# EAGLE design diodes (EAGLE 6.6.0)
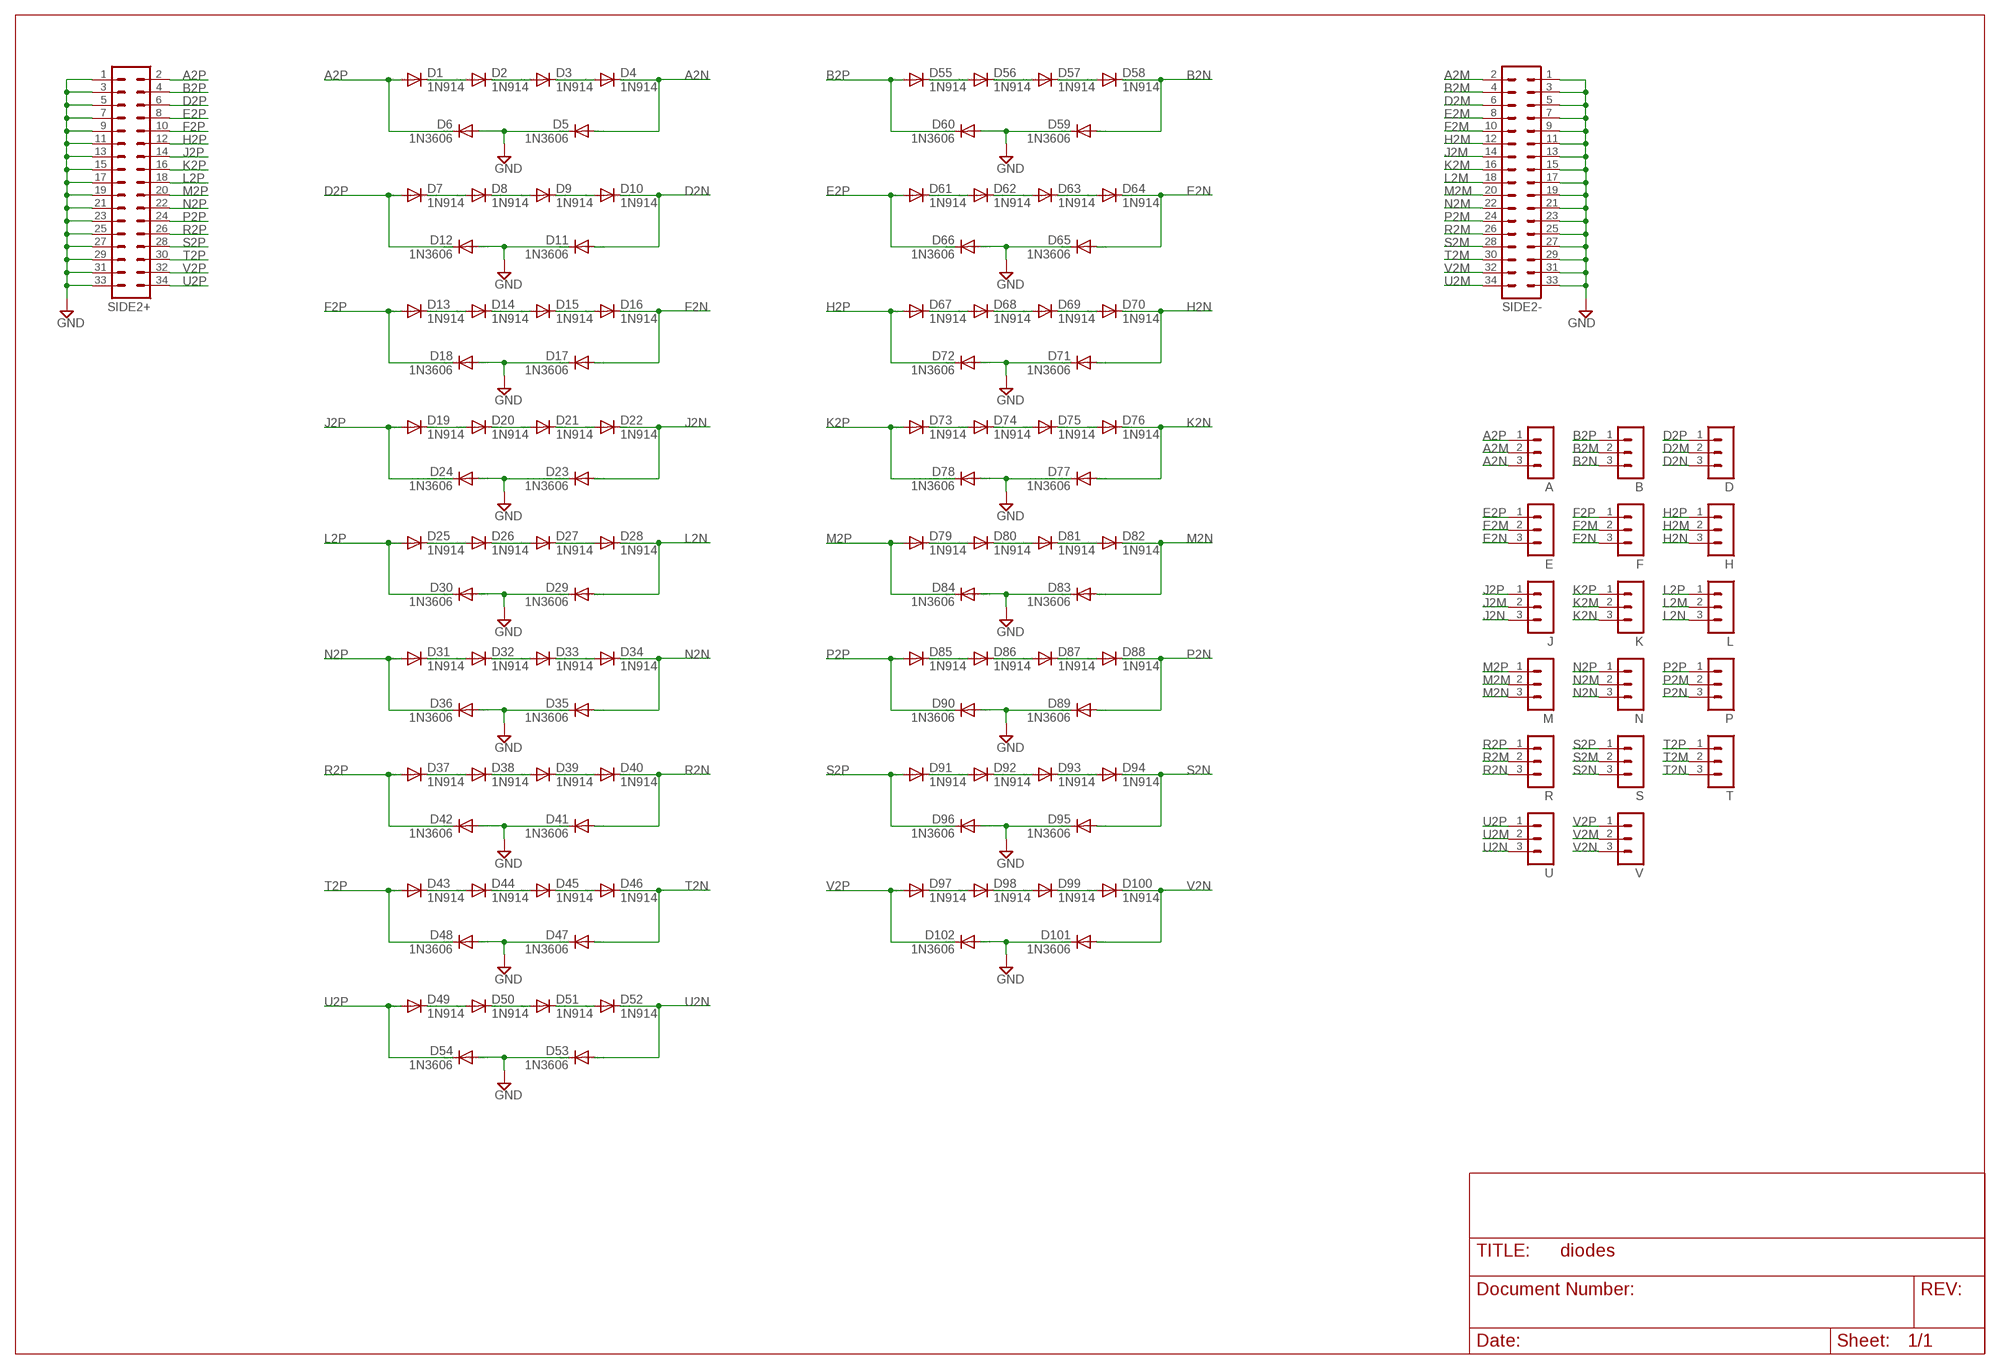
[diagram p0: schematic, sheet 1]

## Parts
A  MA03-1  [MA03-1]
B  MA03-1  [MA03-1]
D  MA03-1  [MA03-1]
D1  1N914  DIODE-DO35-10  [DO35-10]
D2  1N914  DIODE-DO35-10  [DO35-10]
D3  1N914  DIODE-DO35-10  [DO35-10]
D4  1N914  DIODE-DO35-10  [DO35-10]
D5  1N3606  DIODE-DO35-10  [DO35-10]
D6  1N3606  DIODE-DO35-10  [DO35-10]
D7  1N914  DIODE-DO35-10  [DO35-10]
D8  1N914  DIODE-DO35-10  [DO35-10]
D9  1N914  DIODE-DO35-10  [DO35-10]
D10  1N914  DIODE-DO35-10  [DO35-10]
D11  1N3606  DIODE-DO35-10  [DO35-10]
D12  1N3606  DIODE-DO35-10  [DO35-10]
D13  1N914  DIODE-DO35-10  [DO35-10]
D14  1N914  DIODE-DO35-10  [DO35-10]
D15  1N914  DIODE-DO35-10  [DO35-10]
D16  1N914  DIODE-DO35-10  [DO35-10]
D17  1N3606  DIODE-DO35-10  [DO35-10]
D18  1N3606  DIODE-DO35-10  [DO35-10]
D19  1N914  DIODE-DO35-10  [DO35-10]
D20  1N914  DIODE-DO35-10  [DO35-10]
D21  1N914  DIODE-DO35-10  [DO35-10]
D22  1N914  DIODE-DO35-10  [DO35-10]
D23  1N3606  DIODE-DO35-10  [DO35-10]
D24  1N3606  DIODE-DO35-10  [DO35-10]
D25  1N914  DIODE-DO35-10  [DO35-10]
D26  1N914  DIODE-DO35-10  [DO35-10]
D27  1N914  DIODE-DO35-10  [DO35-10]
D28  1N914  DIODE-DO35-10  [DO35-10]
D29  1N3606  DIODE-DO35-10  [DO35-10]
D30  1N3606  DIODE-DO35-10  [DO35-10]
D31  1N914  DIODE-DO35-10  [DO35-10]
D32  1N914  DIODE-DO35-10  [DO35-10]
D33  1N914  DIODE-DO35-10  [DO35-10]
D34  1N914  DIODE-DO35-10  [DO35-10]
D35  1N3606  DIODE-DO35-10  [DO35-10]
D36  1N3606  DIODE-DO35-10  [DO35-10]
D37  1N914  DIODE-DO35-10  [DO35-10]
D38  1N914  DIODE-DO35-10  [DO35-10]
D39  1N914  DIODE-DO35-10  [DO35-10]
D40  1N914  DIODE-DO35-10  [DO35-10]
D41  1N3606  DIODE-DO35-10  [DO35-10]
D42  1N3606  DIODE-DO35-10  [DO35-10]
D43  1N914  DIODE-DO35-10  [DO35-10]
D44  1N914  DIODE-DO35-10  [DO35-10]
D45  1N914  DIODE-DO35-10  [DO35-10]
D46  1N914  DIODE-DO35-10  [DO35-10]
D47  1N3606  DIODE-DO35-10  [DO35-10]
D48  1N3606  DIODE-DO35-10  [DO35-10]
D49  1N914  DIODE-DO35-10  [DO35-10]
D50  1N914  DIODE-DO35-10  [DO35-10]
D51  1N914  DIODE-DO35-10  [DO35-10]
D52  1N914  DIODE-DO35-10  [DO35-10]
D53  1N3606  DIODE-DO35-10  [DO35-10]
D54  1N3606  DIODE-DO35-10  [DO35-10]
D55  1N914  DIODE-DO35-10  [DO35-10]
D56  1N914  DIODE-DO35-10  [DO35-10]
D57  1N914  DIODE-DO35-10  [DO35-10]
D58  1N914  DIODE-DO35-10  [DO35-10]
D59  1N3606  DIODE-DO35-10  [DO35-10]
D60  1N3606  DIODE-DO35-10  [DO35-10]
D61  1N914  DIODE-DO35-10  [DO35-10]
D62  1N914  DIODE-DO35-10  [DO35-10]
D63  1N914  DIODE-DO35-10  [DO35-10]
D64  1N914  DIODE-DO35-10  [DO35-10]
D65  1N3606  DIODE-DO35-10  [DO35-10]
D66  1N3606  DIODE-DO35-10  [DO35-10]
D67  1N914  DIODE-DO35-10  [DO35-10]
D68  1N914  DIODE-DO35-10  [DO35-10]
D69  1N914  DIODE-DO35-10  [DO35-10]
D70  1N914  DIODE-DO35-10  [DO35-10]
D71  1N3606  DIODE-DO35-10  [DO35-10]
D72  1N3606  DIODE-DO35-10  [DO35-10]
D73  1N914  DIODE-DO35-10  [DO35-10]
D74  1N914  DIODE-DO35-10  [DO35-10]
D75  1N914  DIODE-DO35-10  [DO35-10]
D76  1N914  DIODE-DO35-10  [DO35-10]
D77  1N3606  DIODE-DO35-10  [DO35-10]
D78  1N3606  DIODE-DO35-10  [DO35-10]
D79  1N914  DIODE-DO35-10  [DO35-10]
D80  1N914  DIODE-DO35-10  [DO35-10]
D81  1N914  DIODE-DO35-10  [DO35-10]
D82  1N914  DIODE-DO35-10  [DO35-10]
D83  1N3606  DIODE-DO35-10  [DO35-10]
D84  1N3606  DIODE-DO35-10  [DO35-10]
D85  1N914  DIODE-DO35-10  [DO35-10]
D86  1N914  DIODE-DO35-10  [DO35-10]
D87  1N914  DIODE-DO35-10  [DO35-10]
D88  1N914  DIODE-DO35-10  [DO35-10]
D89  1N3606  DIODE-DO35-10  [DO35-10]
D90  1N3606  DIODE-DO35-10  [DO35-10]
D91  1N914  DIODE-DO35-10  [DO35-10]
D92  1N914  DIODE-DO35-10  [DO35-10]
D93  1N914  DIODE-DO35-10  [DO35-10]
D94  1N914  DIODE-DO35-10  [DO35-10]
D95  1N3606  DIODE-DO35-10  [DO35-10]
D96  1N3606  DIODE-DO35-10  [DO35-10]
D97  1N914  DIODE-DO35-10  [DO35-10]
D98  1N914  DIODE-DO35-10  [DO35-10]
D99  1N914  DIODE-DO35-10  [DO35-10]
D100  1N914  DIODE-DO35-10  [DO35-10]
D101  1N3606  DIODE-DO35-10  [DO35-10]
D102  1N3606  DIODE-DO35-10  [DO35-10]
E  MA03-1  [MA03-1]
F  MA03-1  [MA03-1]
H  MA03-1  [MA03-1]
J  MA03-1  [MA03-1]
K  MA03-1  [MA03-1]
L  MA03-1  [MA03-1]
M  MA03-1  [MA03-1]
N  MA03-1  [MA03-1]
P  MA03-1  [MA03-1]
R  MA03-1  [MA03-1]
S  MA03-1  [MA03-1]
SIDE2+  MA17-2  [MA17-2]
SIDE2-  MA17-2  [MA17-2]
T  MA03-1  [MA03-1]
U  MA03-1  [MA03-1]
V  MA03-1  [MA03-1]

## Nets
A2M: A.2 SIDE2-.2
A2N: A.3 D4.C D5.A
A2P: A.1 D1.A D6.C SIDE2+.2
B2M: B.2 SIDE2-.4
B2N: B.3 D58.C D59.A
B2P: B.1 D55.A D60.C SIDE2+.4
D2M: D.2 SIDE2-.6
D2N: D10.C D11.A D.3
D2P: D7.A D12.C D.1 SIDE2+.6
E2M: E.2 SIDE2-.8
E2N: D64.C D65.A E.3
E2P: D61.A D66.C E.1 SIDE2+.8
F2M: F.2 SIDE2-.10
F2N: D16.C D17.A F.3
F2P: D13.A D18.C F.1 SIDE2+.10
GND [Supply]: D5.C D6.A D11.C D12.A D17.C D18.A D23.C D24.A D29.C D30.A D35.C D36.A D41.C D42.A D47.C D48.A D53.C D54.A D59.C D60.A D65.C D66.A D71.C D72.A D77.C D78.A D83.C D84.A D89.C D90.A D95.C D96.A D101.C D102.A SIDE2+.1 SIDE2+.3 SIDE2+.5 SIDE2+.7 SIDE2+.9 SIDE2+.11 SIDE2+.13 SIDE2+.15 SIDE2+.17 SIDE2+.19 SIDE2+.21 SIDE2+.23 SIDE2+.25 SIDE2+.27 SIDE2+.29 SIDE2+.31 SIDE2+.33 SIDE2-.1 SIDE2-.3 SIDE2-.5 SIDE2-.7 SIDE2-.9 SIDE2-.11 SIDE2-.13 SIDE2-.15 SIDE2-.17 SIDE2-.19 SIDE2-.21 SIDE2-.23 SIDE2-.25 SIDE2-.27 SIDE2-.29 SIDE2-.31 SIDE2-.33
H2M: H.2 SIDE2-.12
H2N: D70.C D71.A H.3
H2P: D67.A D72.C H.1 SIDE2+.12
J2M: J.2 SIDE2-.14
J2N: D22.C D23.A J.3
J2P: D19.A D24.C J.1 SIDE2+.14
K2M: K.2 SIDE2-.16
K2N: D76.C D77.A K.3
K2P: D73.A D78.C K.1 SIDE2+.16
L2M: L.2 SIDE2-.18
L2N: D28.C D29.A L.3
L2P: D25.A D30.C L.1 SIDE2+.18
M2M: M.2 SIDE2-.20
M2N: D82.C D83.A M.3
M2P: D79.A D84.C M.1 SIDE2+.20
N2M: N.2 SIDE2-.22
N2N: D34.C D35.A N.3
N2P: D31.A D36.C N.1 SIDE2+.22
N$1: D1.C D2.A
N$2: D2.C D3.A
N$3: D3.C D4.A
N$4: D7.C D8.A
N$5: D8.C D9.A
N$6: D9.C D10.A
N$7: D13.C D14.A
N$8: D14.C D15.A
N$9: D15.C D16.A
N$10: D19.C D20.A
N$11: D20.C D21.A
N$12: D21.C D22.A
N$13: D25.C D26.A
N$14: D26.C D27.A
N$15: D27.C D28.A
N$16: D31.C D32.A
N$17: D32.C D33.A
N$18: D33.C D34.A
N$19: D37.C D38.A
N$20: D38.C D39.A
N$21: D39.C D40.A
N$22: D43.C D44.A
N$23: D44.C D45.A
N$24: D45.C D46.A
N$25: D49.C D50.A
N$26: D50.C D51.A
N$27: D51.C D52.A
N$28: D55.C D56.A
N$29: D56.C D57.A
N$30: D57.C D58.A
N$31: D61.C D62.A
N$32: D62.C D63.A
N$33: D63.C D64.A
N$34: D67.C D68.A
N$35: D68.C D69.A
N$36: D69.C D70.A
N$37: D73.C D74.A
N$38: D74.C D75.A
N$39: D75.C D76.A
N$40: D79.C D80.A
N$41: D80.C D81.A
N$42: D81.C D82.A
N$43: D85.C D86.A
N$44: D86.C D87.A
N$45: D87.C D88.A
N$46: D91.C D92.A
N$47: D92.C D93.A
N$48: D93.C D94.A
N$49: D97.C D98.A
N$50: D98.C D99.A
N$51: D99.C D100.A
P2M: P.2 SIDE2-.24
P2N: D88.C D89.A P.3
P2P: D85.A D90.C P.1 SIDE2+.24
R2M: R.2 SIDE2-.26
R2N: D40.C D41.A R.3
R2P: D37.A D42.C R.1 SIDE2+.26
S2M: S.2 SIDE2-.28
S2N: D94.C D95.A S.3
S2P: D91.A D96.C S.1 SIDE2+.28
T2M: SIDE2-.30 T.2
T2N: D46.C D47.A T.3
T2P: D43.A D48.C SIDE2+.30 T.1
U2M: SIDE2-.34 U.2
U2N: D52.C D53.A U.3
U2P: D49.A D54.C SIDE2+.34 U.1
V2M: SIDE2-.32 V.2
V2N: D100.C D101.A V.3
V2P: D97.A D102.C SIDE2+.32 V.1

## Library data of the parts
A B D E F H J K L M N P R S T U V = con-lstb:MA03-1: PIN HEADER; OC_FARNELL: unknown; OC_NEWARK: unknown
D1-D102 = diode:DIODE-: DIODE
SIDE2+ SIDE2- = con-lstb:MA17-2: PIN HEADER; OC_FARNELL: unknown; OC_NEWARK: unknown

## Net classes
1 Supply: width 0.813 mm

## Board
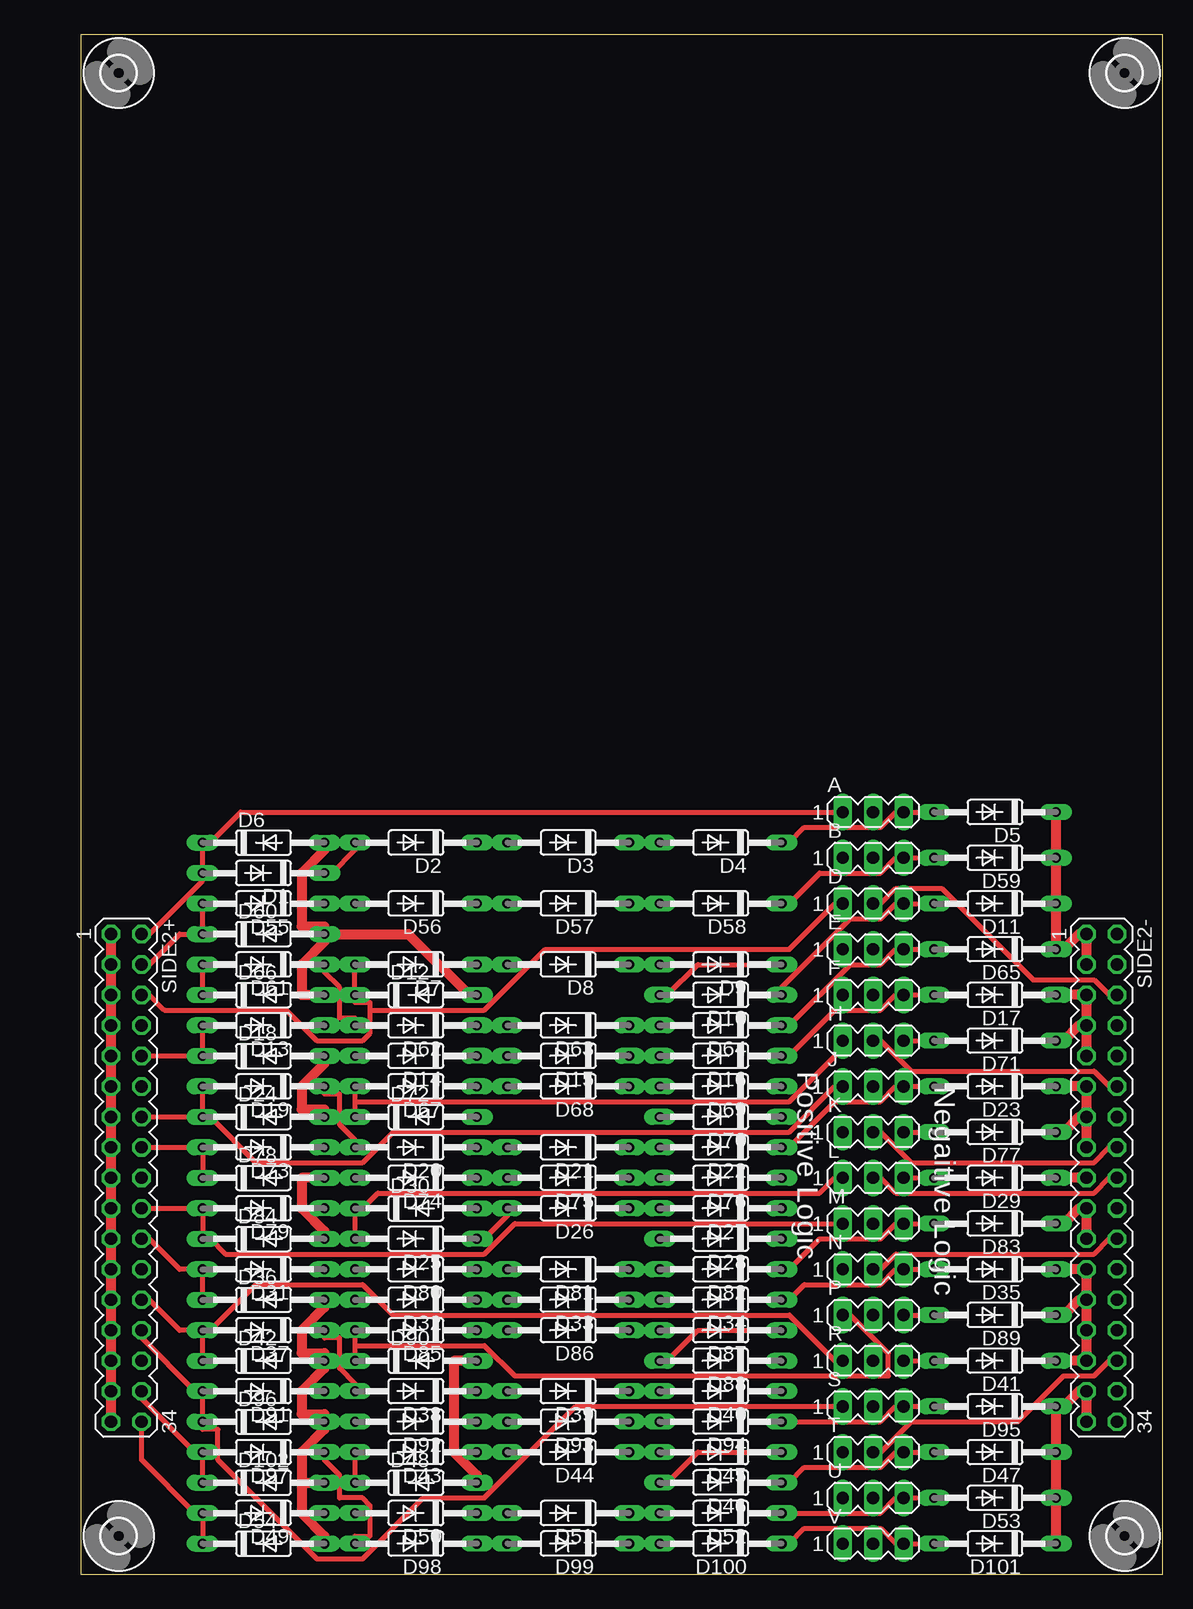
[diagram p1: board, top side]
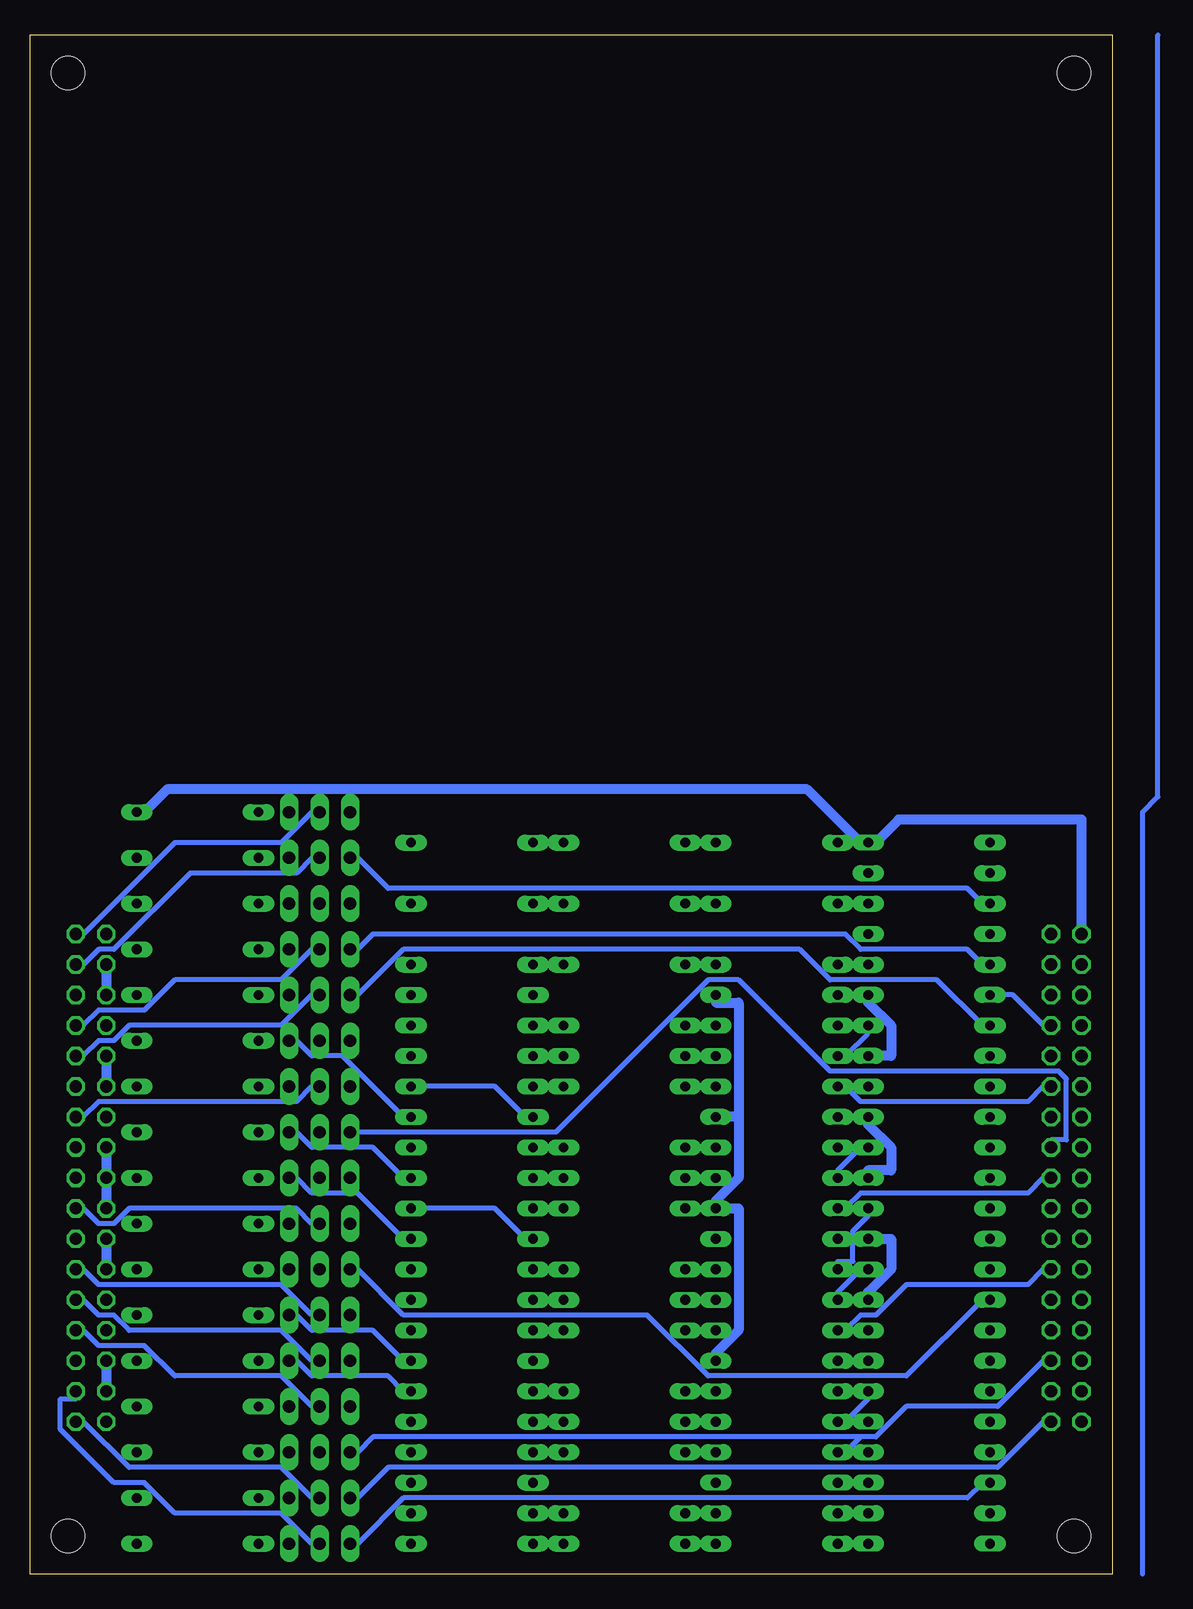
[diagram p2: board, bottom side, seen from below]

Size 90.17 x 128.27 mm. Coordinates in mm from the lower left corner, seen from the top.
Outline: 0,0 90.17,0 90.17,128.27 0,128.27 0,0
Copper layers (1+16): Top 0.035mm / dielectric 1.5mm / Bottom 0.035mm
Design rules "16mils": minimum track width 16mil, minimum drill 32mil, track to track 15mil, track to pad 10mil, pad to pad 10mil, via to via 10mil, smd to smd 10mil, copper to edge 13mil, drill to drill 10mil, minimum pad ring 10mil, minimum via ring 8mil, stop-mask expansion 0mil, vias tented up to drill 0mil, thermal gap 10mil

### Footprints (pad centres in the part's own frame; a part is rotated, then mirrored left to right if it is on the bottom)
MA03-1 = drill 1.016 long: 1 -2.54,0; 2 0,0; 3 2.54,0
DO35-10 = drill 0.813 long: A 5.08,0; C -5.08,0
MA17-2 = drill 1.016 octagon: 1 -20.32,-1.27; 2 -20.32,1.27; 3 -17.78,-1.27; 4 -17.78,1.27; 5 -15.24,-1.27; 6 -15.24,1.27; 7 -12.7,-1.27; 8 -12.7,1.27; 9 -10.16,-1.27; 10 -10.16,1.27; 11 -7.62,-1.27; 12 -7.62,1.27; 13 -5.08,-1.27; 14 -5.08,1.27; 15 -2.54,-1.27; 16 -2.54,1.27; 17 0,-1.27; 18 0,1.27; 19 2.54,-1.27; 20 2.54,1.27; 21 5.08,-1.27; 22 5.08,1.27; 23 7.62,-1.27; 24 7.62,1.27; 25 10.16,-1.27; 26 10.16,1.27; 27 12.7,-1.27; 28 12.7,1.27; 29 15.24,-1.27; 30 15.24,1.27; 31 17.78,-1.27; 32 17.78,1.27; 33 20.32,-1.27; 34 20.32,1.27
2,8 = hole 2.8: 0,0

### Placement (x,y rotation side)
A  66.04,63.5 0 top
B  66.04,59.69 0 top
D  66.04,55.88 0 top
D1  15.24,58.42 180 top
D2  27.94,60.96 180 top
D3  40.64,60.96 180 top
D4  53.34,60.96 180 top
D5  76.2,63.5 180 top
D6  15.24,60.96 0 top
D7  27.94,50.8 180 top
D8  40.64,50.8 180 top
D9  53.34,50.8 180 top
D10  53.34,48.26 180 top
D11  76.2,55.88 180 top
D12  27.94,48.26 0 top
D13  15.24,45.72 180 top
D14  27.94,43.18 180 top
D15  40.64,43.18 180 top
D16  53.34,43.18 180 top
D17  76.2,48.26 180 top
D18  15.24,43.18 0 top
D19  15.24,40.64 180 top
D20  27.94,35.56 180 top
D21  40.64,35.56 180 top
D22  53.34,35.56 180 top
D23  76.2,40.64 180 top
D24  15.24,38.1 0 top
D25  27.94,27.94 180 top
D26  40.64,30.48 180 top
D27  53.34,30.48 180 top
D28  53.34,27.94 180 top
D29  76.2,33.02 180 top
D30  27.94,30.48 0 top
D31  15.24,25.4 180 top
D32  27.94,22.86 180 top
D33  40.64,22.86 180 top
D34  53.34,22.86 180 top
D35  76.2,25.4 180 top
D36  15.24,22.86 0 top
D37  15.24,20.32 180 top
D38  27.94,15.24 180 top
D39  40.64,15.24 180 top
D40  53.34,15.24 180 top
D41  76.2,17.78 180 top
D42  15.24,17.78 0 top
D43  27.94,10.16 180 top
D44  40.64,10.16 180 top
D45  53.34,10.16 180 top
D46  53.34,7.62 180 top
D47  76.2,10.16 180 top
D48  27.94,7.62 0 top
D49  15.24,5.08 180 top
D50  27.94,5.08 180 top
D51  40.64,5.08 180 top
D52  53.34,5.08 180 top
D53  76.2,6.35 180 top
D54  15.24,2.54 0 top
D55  15.24,55.88 180 top
D56  27.94,55.88 180 top
D57  40.64,55.88 180 top
D58  53.34,55.88 180 top
D59  76.2,59.69 180 top
D60  15.24,53.34 0 top
D61  15.24,50.8 180 top
D62  27.94,45.72 180 top
D63  40.64,45.72 180 top
D64  53.34,45.72 180 top
D65  76.2,52.07 180 top
D66  15.24,48.26 0 top
D67  27.94,40.64 180 top
D68  40.64,40.64 180 top
D69  53.34,40.64 180 top
D70  53.34,38.1 180 top
D71  76.2,44.45 180 top
D72  27.94,38.1 0 top
D73  15.24,35.56 180 top
D74  27.94,33.02 180 top
D75  40.64,33.02 180 top
D76  53.34,33.02 180 top
D77  76.2,36.83 180 top
D78  15.24,33.02 0 top
D79  15.24,30.48 180 top
D80  27.94,25.4 180 top
D81  40.64,25.4 180 top
D82  53.34,25.4 180 top
D83  76.2,29.21 180 top
D84  15.24,27.94 0 top
D85  27.94,20.32 180 top
D86  40.64,20.32 180 top
D87  53.34,20.32 180 top
D88  53.34,17.78 180 top
D89  76.2,21.59 180 top
D90  27.94,17.78 0 top
D91  15.24,15.24 180 top
D92  27.94,12.7 180 top
D93  40.64,12.7 180 top
D94  53.34,12.7 180 top
D95  76.2,13.97 180 top
D96  15.24,12.7 0 top
D97  15.24,10.16 180 top
D98  27.94,2.54 180 top
D99  40.64,2.54 180 top
D100  53.34,2.54 180 top
D101  76.2,2.54 180 top
D102  15.24,7.62 0 top
E  66.04,52.07 0 top
F  66.04,48.26 0 top
H  66.04,44.45 0 top
J  66.04,40.64 0 top
K  66.04,36.83 0 top
L  66.04,33.02 0 top
M  66.04,29.21 0 top
N  66.04,25.4 0 top
P  66.04,21.59 0 top
R  66.04,17.78 0 top
S  66.04,13.97 0 top
SIDE2+  3.81,33.02 270 top
SIDE2-  85.09,33.02 270 top
T  66.04,10.16 0 top
U  66.04,6.35 0 top
U$1  [2,8]  3.17,3.17 0 top
U$2  [2,8]  3.17,125.09 0 top
U$3  [2,8]  87,125.09 0 top
U$4  [2,8]  87,3.17 0 top
V  66.04,2.54 0 top

### Tracks (layer width: path | path; a pad name or v marks a point on that pad's centre or on a via)
A2M
  Bottom 0.406: A.2 66.67,63.5 69.22,60.96 78.11,60.96 85.72,53.34 SIDE2-.2
A2N
  Top 0.406: D4.C 59.05,60.96 60.33,62.23 66.67,62.23 67.94,63.5 A.3 D5.A
A2P
  Top 0.406: SIDE2+.2 5.71,53.34 10.16,57.78 D1.A D6.C 10.79,60.96 13.34,63.5 A.1
B2M
  Bottom 0.406: SIDE2-.4 85.72,50.8 84.45,52.07 83.19,52.07 76.83,58.42 67.94,58.42 66.67,59.69 B.2
B2N
  Top 0.406: D58.C 59.05,55.88 61.59,58.42 66.67,58.42 67.94,59.69 B.3 D59.A
B2P
  Top 0.406: D55.A D60.C 8.26,53.34 5.71,50.8 SIDE2+.4
  Bottom 0.406: B.1 62.87,59.69 60.33,57.15 12.06,57.15 10.79,55.88 D55.A
D2M
  Top 0.406: SIDE2-.6 85.72,48.26 84.45,49.53 79.38,49.53 71.75,57.15 67.94,57.15 66.67,55.88 D.2
D2N
  Top 0.406: D10.C 58.42,48.9 64.14,54.61 66.67,54.61 67.94,55.88 D.3 D11.A
D2P
  Top 0.406: D7.A D12.C 22.86,47.62 24.13,47.62 24.13,46.99 | 24.13,46.99 24.13,45.09 23.5,44.45 19.68,44.45 17.14,46.99 6.99,46.99 5.71,48.26 SIDE2+.6 | 24.13,46.99 33.66,46.99 38.73,52.07 59.05,52.07 62.87,55.88 D.1
E2M
  Bottom 0.406: E.2 66.67,52.07 69.22,49.53 78.11,49.53 80.64,46.99 84.45,46.99 85.72,45.72 SIDE2-.8
E2N
  Top 0.406: D64.C 59.05,45.72 64.14,50.8 66.67,50.8 67.94,52.07 E.3 D65.A
E2P
  Top 0.406: D66.C D61.A
  Bottom 0.406: SIDE2+.8 5.71,45.72 8.26,48.26 D66.C | E.1 62.87,52.07 61.59,53.34 22.23,53.34 20.95,52.07 12.06,52.07 10.79,50.8 D61.A
F2M
  Bottom 0.406: F.2 66.67,48.26 69.22,45.72 81.92,45.72 83.19,44.45 84.45,44.45 85.72,43.18 SIDE2-.10
F2N
  Top 0.406: D16.C 59.05,43.18 62.87,46.99 66.67,46.99 67.94,48.26 F.3 D17.A
F2P
  Top 0.406: D13.A D18.C SIDE2+.10
  Bottom 0.406: F.1 62.87,48.26 59.05,52.07 26.04,52.07 23.5,49.53 14.61,49.53 10.79,45.72 D13.A
GND
  Top 0.813: D71.C 81.92,44.45 83.19,45.72 SIDE2-.7 | D23.C SIDE2-.11 SIDE2-.13 | SIDE2-.7 SIDE2-.9 | D17.C SIDE2-.5 SIDE2-.7 | D5.C D59.C D11.C D65.C 81.92,52.07 83.19,53.34 SIDE2-.1 SIDE2-.3 | D83.C 81.92,29.21 83.19,30.48 SIDE2-.19 SIDE2-.21 | D35.C SIDE2-.23 SIDE2-.25 | D77.C 81.92,36.83 83.19,38.1 SIDE2-.13 | SIDE2-.17 D29.C | SIDE2-.13 SIDE2-.15 | D101.C D53.C D47.C D95.C 81.92,13.97 83.19,15.24 SIDE2-.31 SIDE2-.33 | D89.C 81.92,21.59 83.19,22.86 SIDE2-.25 | D41.C SIDE2-.29 SIDE2-.27 SIDE2-.25 | SIDE2+.33 SIDE2+.31 SIDE2+.29 SIDE2+.27 SIDE2+.25 SIDE2+.23 SIDE2+.21 SIDE2+.19 SIDE2+.17 SIDE2+.15 SIDE2+.13 SIDE2+.11 SIDE2+.9 SIDE2+.7 SIDE2+.5 SIDE2+.3 SIDE2+.1 | 18.41,7.62 18.41,5.08 20.32,3.17 D54.A | 18.41,7.62 D102.A | 18.41,7.62 18.41,10.16 20.32,12.06 D96.A 20.32,13.34 18.41,13.34 18.41,15.24 20.32,17.14 D42.A 20.32,18.41 18.41,18.41 18.41,20.32 20.32,22.23 D36.A | D48.A 33.02,8.26 31.11,10.16 31.11,17.78 D90.A | D84.A 20.32,28.57 18.41,30.48 18.41,33.02 D78.A | D18.A 20.32,42.55 18.41,40.64 18.41,38.73 20.32,38.73 D24.A | D60.A 20.32,52.7 18.41,50.8 18.41,48.26 D66.A | D6.A 20.32,60.33 18.41,58.42 18.41,53.98 20.32,53.98 D60.A | D12.A 32.38,48.26 27.3,53.34 D60.A
  Bottom 0.813: SIDE2-.9 SIDE2-.11 | SIDE2-.3 SIDE2-.5 | SIDE2-.21 SIDE2-.23 | SIDE2-.15 SIDE2-.17 SIDE2-.19 | SIDE2-.29 SIDE2-.31 | 31.11,38.1 31.11,33.02 33.02,31.11 D30.A 31.11,30.48 31.11,20.32 33.02,18.41 D90.A | 31.11,38.1 D72.A | D24.A 20.32,37.47 18.41,35.56 18.41,33.66 20.32,33.66 D78.A | D66.A 20.32,47.62 18.41,45.72 18.41,43.18 D18.A | 31.11,38.1 31.11,47.62 33.02,47.62 D12.A | D36.A 20.32,23.5 18.41,25.4 18.41,27.94 D84.A | SIDE2+.1 2.54,62.87 17.78,62.87 19.68,60.96 D6.A 20.95,60.96 25.4,65.41 78.74,65.41 80.64,63.5 D5.C
H2M
  Top 0.406: H.2 66.67,44.45 69.22,41.91 84.45,41.91 85.72,40.64 SIDE2-.12
H2N
  Top 0.406: H.3 D71.A
  Bottom 0.406: D70.C 59.05,38.1 64.14,43.18 66.67,43.18 67.94,44.45 H.3
H2P
  Top 0.406: 22.86,39.37 D72.C | D67.A 22.86,39.37 | 22.86,39.37 59.05,39.37 63.5,43.81 H.1
  Bottom 0.406: SIDE2+.12 5.71,40.64 6.99,39.37 20.95,39.37 22.23,40.64 D67.A
J2M
  Bottom 0.406: J.2 66.67,40.64 67.94,39.37 84.45,39.37 85.72,38.1 SIDE2-.14
J2N
  Top 0.406: D22.C 59.05,35.56 62.87,39.37 66.67,39.37 67.94,40.64 J.3 D23.A
J2P
  Top 0.406: D24.C D19.A | SIDE2+.14 D24.C | J.1 62.87,40.64 59.05,36.83 26.04,36.83 23.5,34.29 14.61,34.29 10.79,38.1 D24.C
K2M
  Top 0.406: K.2 66.67,36.83 69.22,34.29 84.45,34.29 85.72,35.56 SIDE2-.16
K2N
  Top 0.406: K.3 D77.A
  Bottom 0.406: D76.C 59.05,33.02 61.59,35.56 66.67,35.56 67.94,36.83 K.3
K2P
  Top 0.406: D78.C D73.A SIDE2+.16
  Bottom 0.406: K.1 46.35,36.83 33.66,49.53 31.11,49.53 23.5,41.91 4.45,41.91 3.81,41.27 3.81,36.2 5.08,36.2 SIDE2+.16
L2M
  Top 0.406: L.2 66.67,33.02 67.94,31.75 84.45,31.75 85.72,33.02 SIDE2-.18
L2N
  Top 0.406: L.3 D29.A
  Bottom 0.406: D28.C 59.05,27.94 62.87,31.75 66.67,31.75 67.94,33.02 L.3
L2P
  Top 0.406: D25.A D30.C 23.5,30.48 24.77,31.75 61.59,31.75 62.87,33.02 L.1
  Bottom 0.406: SIDE2+.18 5.71,33.02 6.99,31.75 20.95,31.75 22.23,30.48 D30.C
M2M
  Bottom 0.406: M.2 66.67,29.21 67.94,30.48 81.92,30.48 83.19,29.21 84.45,29.21 85.72,30.48 SIDE2-.20
M2N
  Top 0.406: D82.C 59.05,25.4 61.59,27.94 66.67,27.94 67.94,29.21 M.3 D83.A
M2P
  Top 0.406: SIDE2+.20 D79.A D84.C 10.79,27.94 12.06,26.67 33.66,26.67 36.2,29.21 M.1
N2M
  Top 0.406: N.2 66.67,25.4 67.94,26.67 84.45,26.67 85.72,27.94 SIDE2-.22
N2N
  Top 0.406: D34.C 59.05,22.86 60.33,24.13 66.67,24.13 67.94,25.4 N.3 D35.A
N2P
  Top 0.406: D36.C D31.A 8.26,25.4 5.71,27.94 SIDE2+.22
  Bottom 0.406: N.1 62.87,25.4 59.05,21.59 38.73,21.59 33.66,16.51 17.14,16.51 10.79,22.86 D36.C
N$1
  Top 0.406: D1.C 20.95,58.42 22.86,60.33 D2.A
N$2
  Top 0.406: D2.C D3.A
N$3
  Top 0.406: D3.C D4.A
N$4
  Top 0.406: D7.C D8.A
N$5
  Top 0.406: D8.C D9.A
N$6
  Top 0.406: D10.A 48.9,48.26 51.44,50.8 D9.C
N$7
  Bottom 0.406: D13.C 20.32,45.09 22.23,43.18 D14.A
N$8
  Top 0.406: D14.C D15.A
N$9
  Top 0.406: D15.C D16.A
N$10
  Top 0.406: D20.A 22.86,36.2 21.59,37.47 21.59,40.01 20.32,40.01 D19.C
N$11
  Top 0.406: D20.C D21.A
N$12
  Top 0.406: D21.C D22.A
N$13
  Top 0.406: D25.C 33.66,27.94 35.56,29.84 D26.A
N$14
  Top 0.406: D26.C D27.A
N$15
  Bottom 0.406: D28.A 48.9,27.94 51.44,30.48 D27.C
N$16
  Bottom 0.406: D32.A 22.86,23.5 20.95,25.4 D31.C
N$17
  Top 0.406: D32.C D33.A
N$18
  Top 0.406: D33.C D34.A
N$19
  Top 0.406: D38.A 22.86,15.88 21.59,17.14 21.59,19.68 20.32,19.68 D37.C
N$20
  Top 0.406: D38.C D39.A
N$21
  Top 0.406: D39.C D40.A
N$22
  Top 0.406: D43.C D44.A
N$23
  Top 0.406: D44.C D45.A
N$24
  Top 0.406: D46.A 48.9,7.62 51.44,10.16 D45.C
N$25
  Top 0.406: D49.C D50.A
N$26
  Top 0.406: D50.C D51.A
N$27
  Top 0.406: D51.C D52.A
N$28
  Top 0.406: D55.C D56.A
N$29
  Top 0.406: D56.C D57.A
N$30
  Top 0.406: D57.C D58.A
N$31
  Top 0.406: D61.C 20.32,50.16 21.59,48.9 21.59,46.35 22.86,46.35 D62.A
N$32
  Top 0.406: D62.C D63.A
N$33
  Top 0.406: D63.C D64.A
N$34
  Top 0.406: D67.C D68.A
N$35
  Top 0.406: D68.C D69.A
N$36
  Bottom 0.406: D70.A 48.9,38.1 51.44,40.64 D69.C
N$37
  Bottom 0.406: D74.A 22.86,33.66 20.95,35.56 D73.C
N$38
  Top 0.406: D74.C D75.A
N$39
  Top 0.406: D75.C D76.A
N$40
  Bottom 0.406: D79.C 20.32,29.84 21.59,28.57 21.59,26.04 22.86,26.04 D80.A
N$41
  Top 0.406: D80.C D81.A
N$42
  Top 0.406: D81.C D82.A
N$43
  Top 0.406: D85.C D86.A
N$44
  Top 0.406: D86.C D87.A
N$45
  Top 0.406: D88.A 48.9,17.78 51.44,20.32 D87.C
N$46
  Bottom 0.406: D92.A 22.23,12.7 20.32,14.61 D91.C
N$47
  Top 0.406: D92.C D93.A
N$48
  Top 0.406: D93.C D94.A
N$49
  Top 0.406: D97.C 20.32,9.53 21.59,8.26 21.59,6.35 23.5,6.35 24.13,5.71 24.13,3.17 22.86,3.17 D98.A
N$50
  Top 0.406: D98.C D99.A
N$51
  Top 0.406: D99.C D100.A
N$52
  Bottom 0.406: -2.54,0 -2.54,63.5 -3.81,64.77 -3.81,128.27
P2M
  Bottom 0.406: P.2 66.67,21.59 69.22,24.13 84.45,24.13 85.72,25.4 SIDE2-.24
P2N
  Top 0.406: P.3 D89.A
  Bottom 0.406: D88.C 59.05,17.78 61.59,20.32 66.67,20.32 67.94,21.59 P.3
P2P
  Top 0.406: 22.86,19.05 D90.C | D85.A 22.86,19.05 | 22.86,19.05 33.66,19.05 36.2,16.51 67.31,16.51 67.31,18.41 64.14,21.59 P.1
  Bottom 0.406: SIDE2+.24 5.71,25.4 6.99,24.13 17.14,24.13 19.68,21.59 20.95,21.59 22.23,20.32 D85.A
R2M
  Bottom 0.406: R.2 66.67,17.78 69.22,20.32 81.92,20.32 83.19,21.59 84.45,21.59 85.72,22.86 SIDE2-.26
R2N
  Top 0.406: R.3 D41.A
  Bottom 0.406: D40.C 59.05,15.24 60.33,16.51 66.67,16.51 67.94,17.78 R.3
R2P
  Top 0.406: D42.C D37.A | SIDE2+.26 5.71,22.86 8.26,20.32 D37.A | R.1 62.87,17.78 59.05,21.59 26.04,21.59 23.5,24.13 14.61,24.13 10.79,20.32 D37.A
S2M
  Bottom 0.406: S.2 66.67,13.97 69.22,16.51 78.11,16.51 80.64,19.05 84.45,19.05 85.72,20.32 SIDE2-.28
S2N
  Top 0.406: D94.C 66.67,12.7 67.94,13.97 S.3 D95.A
S2P
  Top 0.406: SIDE2+.28 5.08,19.68 9.53,15.24 D91.A D96.C 10.16,12.06 11.43,12.06 11.43,9.53 19.68,1.27 23.5,1.27 28.57,6.35 33.66,6.35 41.27,13.97 S.1
T2M
  Top 0.406: T.2 66.67,10.16 69.22,12.7 78.11,12.7 81.92,16.51 84.45,16.51 85.72,17.78 SIDE2-.30
T2N
  Top 0.406: D46.C 59.05,7.62 60.33,8.89 66.67,8.89 67.94,10.16 T.3 D47.A
T2P
  Top 0.406: D43.A D48.C
  Bottom 0.406: 20.95,11.43 19.68,11.43 17.14,13.97 9.53,13.97 5.71,17.78 SIDE2+.30 | 20.95,11.43 22.23,10.16 D43.A | 20.95,11.43 61.59,11.43 62.87,10.16 T.1
U2M
  Bottom 0.406: U.2 66.67,6.35 69.22,8.89 81.92,8.89 85.72,12.7 SIDE2-.34
U2N
  Top 0.406: D52.C 66.67,5.08 67.94,6.35 U.3 D53.A
U2P
  Top 0.406: D54.C D49.A 9.53,5.08 5.08,9.53 SIDE2+.34
  Bottom 0.406: U.1 62.87,6.35 60.33,8.89 9.53,8.89 5.71,12.7 SIDE2+.34
V2M
  Bottom 0.406: V.2 66.67,2.54 69.22,5.08 78.11,5.08 80.64,7.62 83.19,7.62 87.63,12.06 87.63,14.61 86.36,14.61 SIDE2-.32
V2N
  Top 0.406: D100.C 59.05,2.54 60.33,3.81 66.67,3.81 67.94,2.54 V.3 D101.A
V2P
  Top 0.406: D102.C D97.A 9.53,10.16 5.08,14.61 SIDE2+.32
  Bottom 0.406: V.1 62.87,2.54 59.05,6.35 12.06,6.35 10.79,7.62 D102.C

### Text on the board
tNames: Positive Logic | Negaitive Logic
tDocu: 1